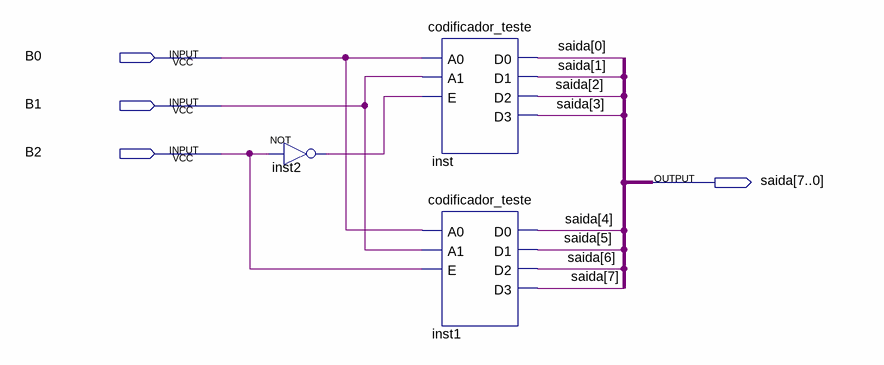
[diagram p0: schematic sheet]
// Quartus schematic codificador_3to8_enable.bdf as structural Verilog: 3 symbols, 4 pins
module codificador_3to8_enable (
  input  B0,
  input  B1,
  input  B2,
  output [7:0] saida
);

  wire inst2_out;

  not inst2 (inst2_out, B2);
  codificador_teste inst (.A0(B0), .A1(B1), .E(inst2_out), .D0(saida[0]), .D1(saida[1]), .D2(saida[2]), .D3(saida[3]));
  codificador_teste inst1 (.A0(B0), .A1(B1), .E(B2), .D0(saida[4]), .D1(saida[5]), .D2(saida[6]), .D3(saida[7]));
endmodule
